# Altium schematic sheet PowerManagement.SchDoc: =DocumentName
size A3; Organization: ORGANIZATION; Address1: R. Aprígio Veloso, 882, Universitário; Address2: Campina Grande - PB; Address3: 58429-900; Revision: -; SheetNumber: 3; SheetTotal: 9; ENG_DATE: --/--/--; DSN_DATE: --/--/--; CHK_DATE: --/--/--; SCH_SCALE: 1:1
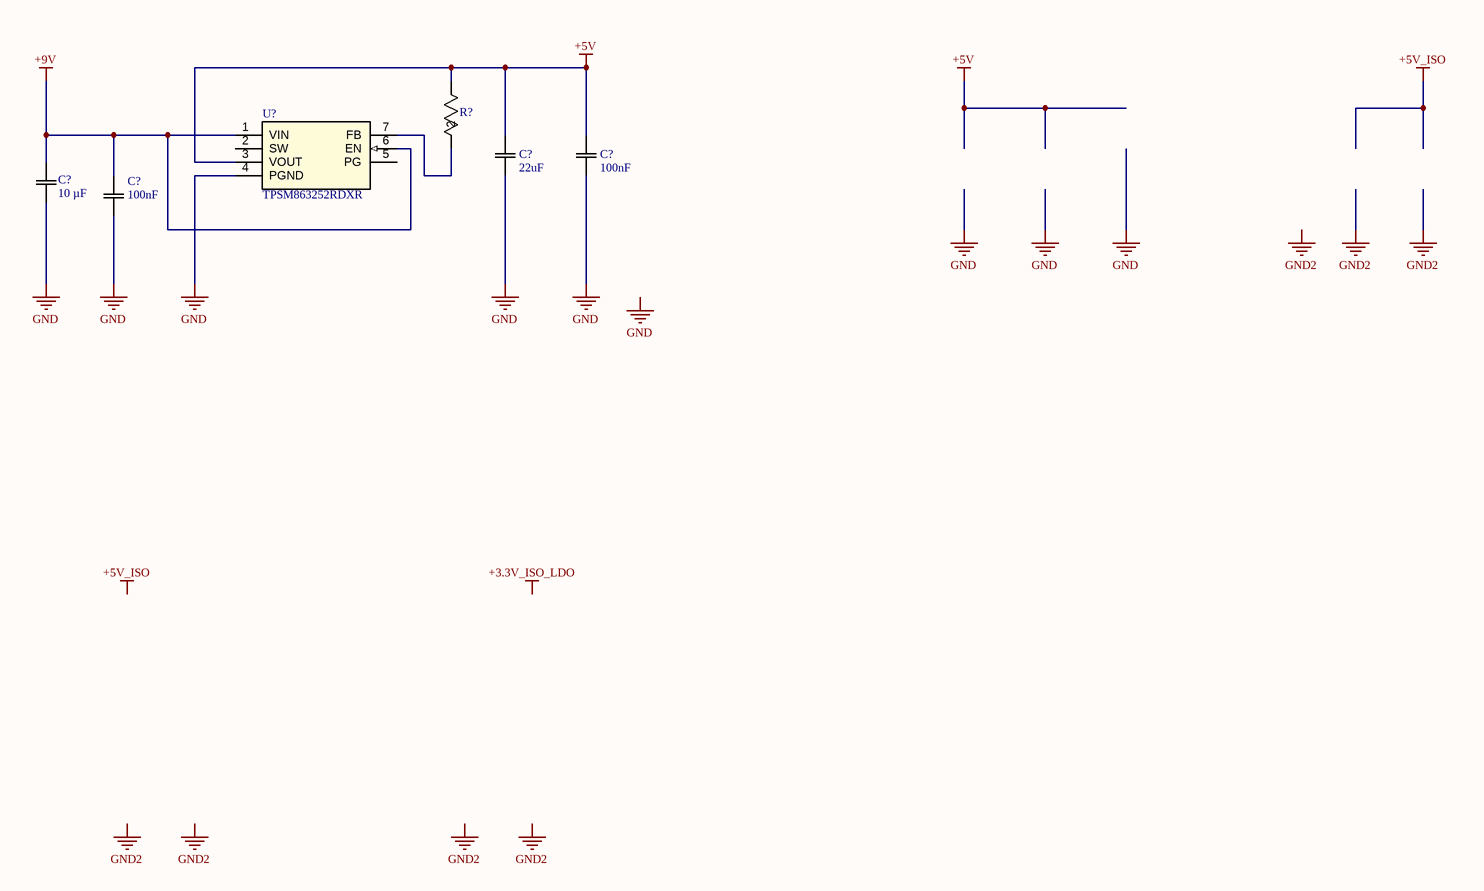
[diagram p0: PowerManagement.SchDoc]

## Parts
(Parts that share a designator on the sheet are numbered #1, #2 ... from top to bottom, then left to right.)
C?#1  value 22uF  [CAP_CL10_SAM]  (hidden comment: CL10A226MO7JZNC)
C?#2  value 100nF  [CAP_GCM15_MUR]  (hidden comment: GCM155R71H104KE02D)
C?#3  value 10 µF  [CAP_CL10_SAM]  (hidden comment: CL10A106MA8NRNC)
C?#4  value 100nF  [CAP_GCM15_MUR]  (hidden comment: GCM155R71H104KE02D)
R?  RC0402FR-07220KL  [RC0402N_YAG]  (value not drawn)
U?  TPSM863252RDXR  [RDX0007A-MFG]

## Nets
+5V: C?#1.2 C?#2.2 R?.1 U?.3(VOUT)
+9V: C?#3.2 C?#4.2 U?.1(VIN) U?.6(EN)
GND: C?#1.1 C?#2.1 C?#3.1 C?#4.1 U?.4(PGND)
NetR?_2: R?.2 U?.7(FB)

Not connected (* = marked no-connect by the designer): U? 2(SW) 5(PG)

## Notes on the sheet
- Labels drawn without touching a wire or pin: +3.3V_ISO_LDO, +5V_ISO, GND, GND2
- REVISION
- DESCRIPTION
- DATE
- APPROVED
- ADDRESS
- PROJECT
- VERSION
- TITLE
- A3
- SIZE
- SCALE
- DOCUMENT NAME:
- DOCUMENT REVISION:
- OF
- SHEET:
- PROJECT REVISION:

## Library data of the parts
C?#1 = CL10A226MO7JZNC: CAP; SMT (0603); 22UF; 20%; 16V; X5R; CERAMIC; Manufacturer_Name: Samsung; Copyright: Copyright (C) 2026 Ultra Librarian. All rights reserved.; Manufacturer_Part_Number: CL10A226MO7JZNC
C?#2 C?#4 = GCM155R71H104KE02D: Description; Manufacturer_Name: Murata; Copyright: Copyright (C) 2026 Ultra Librarian. All rights reserved.; Manufacturer_Part_Number: GCM155R71H104KE02D
C?#3 = CL10A106MA8NRNC: CAP; SMT (0603); 10UF; 20%; 25V; X5R; CERAMIC; Manufacturer_Name: Samsung; Copyright: Copyright (C) 2025 Ultra Librarian. All rights reserved.; Manufacturer_Part_Number: CL10A106MA8NRNC
R? = RC0402FR-07220KL: No Description Available; Manufacturer_Name: Yageo; Copyright: Copyright (C) 2026 Ultra Librarian. All rights reserved.; Manufacturer_Part_Number: RC0402FR-07220KL
U? = TPSM863252RDXR: 3-V to 17-V input voltage, 3-A Eco-mode synchronous buck module 7-QFN-FCMOD -40 to 125; Manufacturer_Name: Texas Instruments; TYPE: TYPE; RefDes: RefDes; Copyright: Copyright (C) 2025 Ultra Librarian. All rights reserved.; Manufacturer_Part_Number: TPSM863252RDXR